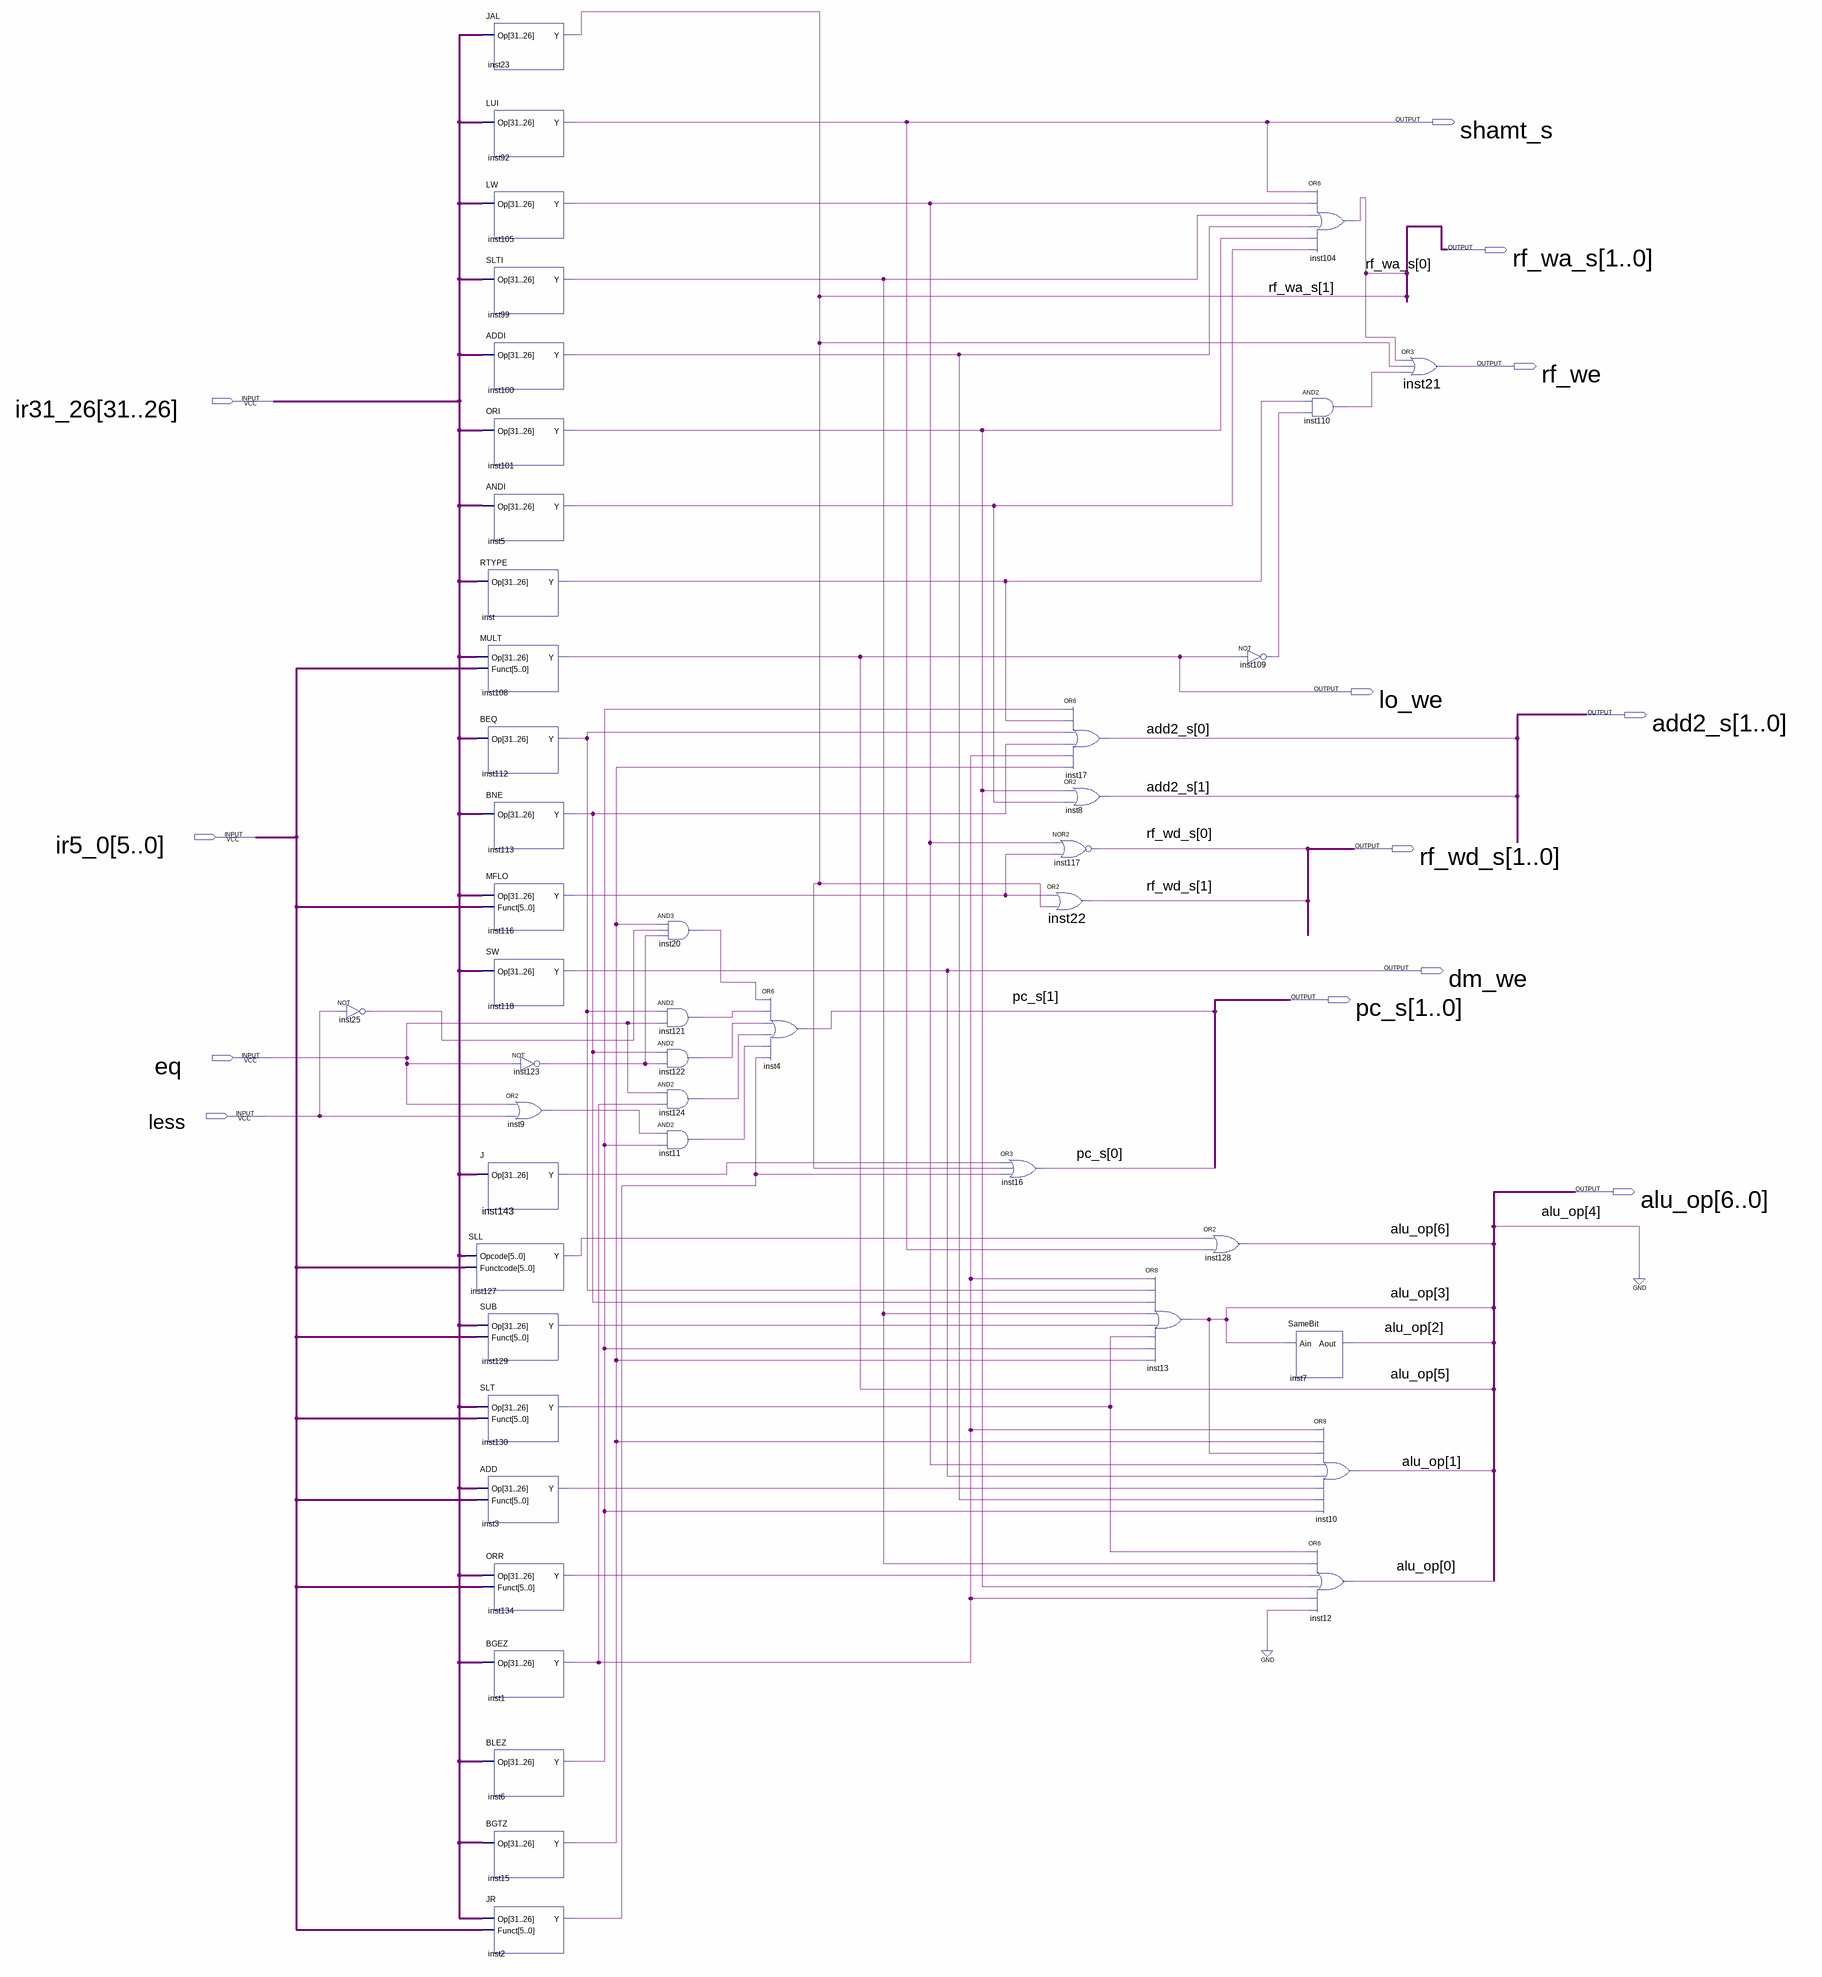
[diagram p0: schematic sheet]
// Quartus schematic CTRL.bdf as structural Verilog: 46 symbols, 13 pins
module CTRL (
  input  [31:26] ir31_26,
  input  [5:0] ir5_0,
  input  eq,
  input  less,
  output shamt_s,
  output [1:0] rf_wa_s,
  output rf_we,
  output lo_we,
  output [1:0] add2_s,
  output [1:0] rf_wd_s,
  output dm_we,
  output [1:0] pc_s,
  output [6:0] alu_op
);

  wire inst1_y, inst2_y, inst3_y, inst5_y, inst6_y, inst9_out, inst11_out, inst15_y, inst20_out, inst25_out,
       inst99_y, inst100_y, inst101_y, inst105_y, inst109_out, inst110_out, inst112_y, inst113_y, inst116_y,
       inst121_out, inst122_out, inst123_out, inst124_out, inst127_y, inst129_y, inst130_y, inst134_y,
       inst143_y, inst_y;

  not inst25 (inst25_out, less);
  JAL inst23 (.Op(ir31_26), .Y(rf_wa_s[1]));
  LUI inst92 (.Op(ir31_26), .Y(shamt_s));
  LW inst105 (.Op(ir31_26), .Y(inst105_y));
  SLTI inst99 (.Op(ir31_26), .Y(inst99_y));
  ADDI inst100 (.Op(ir31_26), .Y(inst100_y));
  ORI inst101 (.Op(ir31_26), .Y(inst101_y));
  ANDI inst5 (.Op(ir31_26), .Y(inst5_y));
  RTYPE inst (.Op(ir31_26), .Y(inst_y));
  MULT inst108 (.Op(ir31_26), .Funct(ir5_0), .Y(alu_op[5]));
  BEQ inst112 (.Op(ir31_26), .Y(inst112_y));
  BNE inst113 (.Op(ir31_26), .Y(inst113_y));
  MFLO inst116 (.Op(ir31_26), .Funct(ir5_0), .Y(inst116_y));
  SW inst118 (.Op(ir31_26), .Y(dm_we));
  J inst143 (.Op(ir31_26), .Y(inst143_y));
  SLL inst127 (.Opcode(ir31_26), .Functcode(ir5_0), .Y(inst127_y));
  SUB inst129 (.Op(ir31_26), .Funct(ir5_0), .Y(inst129_y));
  SLT inst130 (.Op(ir31_26), .Funct(ir5_0), .Y(inst130_y));
  ADD inst3 (.Op(ir31_26), .Funct(ir5_0), .Y(inst3_y));
  ORR inst134 (.Op(ir31_26), .Funct(ir5_0), .Y(inst134_y));
  BGEZ inst1 (.Op(ir31_26), .Y(inst1_y));
  BLEZ inst6 (.Op(ir31_26), .Y(inst6_y));
  BGTZ inst15 (.Op(ir31_26), .Y(inst15_y));
  JR inst2 (.Op(ir31_26), .Funct(ir5_0), .Y(inst2_y));
  not inst123 (inst123_out, eq);
  or inst9 (inst9_out, eq, less);
  and inst20 (inst20_out, inst15_y, inst25_out, inst123_out);
  and inst121 (inst121_out, inst112_y, eq);
  and inst122 (inst122_out, inst113_y, inst123_out);
  and inst124 (inst124_out, eq, inst1_y);
  and inst11 (inst11_out, inst9_out, inst6_y);
  or inst4 (pc_s[1], inst20_out, inst121_out, inst122_out, inst124_out, inst11_out, inst2_y);
  or inst16 (pc_s[0], inst143_y, rf_wa_s[1], inst2_y);
  or inst22 (rf_wd_s[1], inst116_y, rf_wa_s[1]);
  or inst17 (add2_s[0], inst6_y, inst_y, inst112_y, inst113_y, inst1_y, inst15_y);
  or inst8 (add2_s[1], inst101_y, inst5_y);
  nor inst117 (rf_wd_s[0], inst105_y, inst116_y);
  or inst13 (alu_op[3], inst1_y, inst112_y, inst113_y, inst99_y, inst129_y, inst130_y, inst6_y, inst15_y);
  or inst128 (alu_op[6], inst127_y, shamt_s);
  not inst109 (inst109_out, alu_op[5]);
  or inst104 (rf_wa_s[0], shamt_s, inst105_y, inst99_y, inst100_y, inst101_y, inst5_y);
  and inst110 (inst110_out, inst_y, inst109_out);
  SameBit inst7 (.Ain(alu_op[3]), .Aout(alu_op[2]));
  or inst10 (alu_op[1], inst1_y, inst15_y, alu_op[3], inst105_y, dm_we, inst3_y, inst100_y, inst6_y);
  or inst12 (alu_op[0], inst130_y, inst99_y, inst134_y, inst101_y, inst1_y, 1'b0);
  or inst21 (rf_we, rf_wa_s[0], rf_wa_s[1], inst110_out);

  assign alu_op[4] = 1'b0;
  assign lo_we = alu_op[5];
endmodule
